# Altium schematic sheet ControlBoard.SchDoc
size A4; SheetNumber: 1; SheetTotal: 1; SPICEModelCacheKQEIREZP: <root> / <DocumentId>KQEIREZP</DocumentId> / </root>
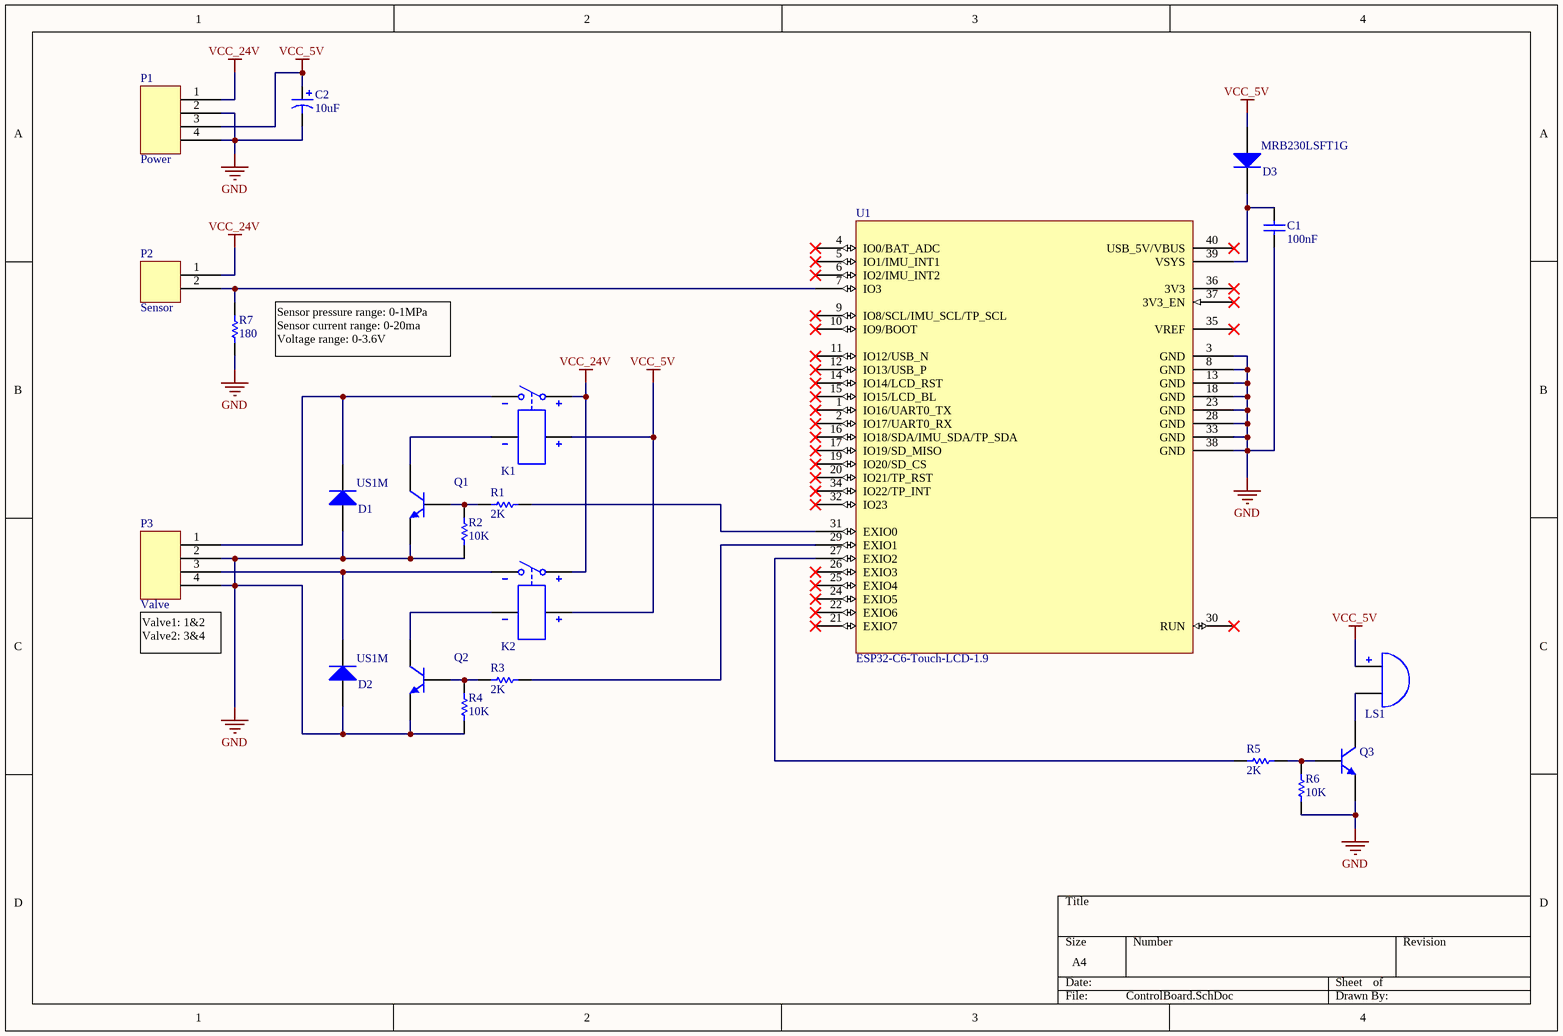
[diagram p0: ControlBoard.SchDoc]

## Parts
C1  value 100nF  [CAP0603/M]  (hidden comment: Cap)
C2  value 10uF  [CAPMP6032/M]  (hidden comment: Cap Pol)
D1  US1M  [DO-214AC/M]
D2  US1M  [DO-214AC/M]
D3  MRB230LSFT1G  [SOD-123FL/M]
K1  ENMG Solid State Relay  [PMN5D6132]  (value not drawn)
K2  ENMG Solid State Relay  [PMN5D6132]  (value not drawn)
LS1  Buzzer  [Buzzer-2310]  (value not drawn)
P1  Power  [KEFA/KF128L-3.81-04P]
P2  Sensor  [KEFA/KF128L-3.81-02P]
P3  Valve  [KEFA/KF128L-3.81-04P]
Q1  NPN  [SOT-23/M]  (value not drawn)
Q2  NPN  [SOT-23/M]  (value not drawn)
Q3  NPN  [SOT-23/M]  (value not drawn)
R1  value 2K  [RES0603/M]  (hidden comment: Res)
R2  value 10K  [RES0603/M]  (hidden comment: Res)
R3  value 2K  [RES0603/M]  (hidden comment: Res)
R4  value 10K  [RES0603/M]  (hidden comment: Res)
R5  value 2K  [RES0603/M]  (hidden comment: Res)
R6  value 10K  [RES0603/M]  (hidden comment: Res)
R7  value 180  [RES2512/L]  (hidden comment: Res)
U1  ESP32-C6-Touch-LCD-1.9  [ESP32-C6-Touch-LCD-1.9_Socket]

## Nets
GND: C1.2 C2.N D1.P(A) D2.P(A) P1.2 P1.4 P3.2 P3.4 Q1.E Q2.E Q3.E R2.1 R4.1 R6.1 R7.2 U1.3(GND) U1.8(GND) U1.13(GND) U1.18(GND) U1.23(GND) U1.28(GND) U1.33(GND) U1.38(GND)
VCC_5V: C2.P D3.P(A) K1.3 K2.3 LS1.P P1.3
VCC_24V: K1.2 K2.2 P1.1 P2.1
NetC1_1: C1.1 D3.N(K) U1.39(VSYS)
NetD1_N: D1.N(K) K1.1 P3.1
NetD2_N: D2.N(K) K2.1 P3.3
NetK1_4: K1.4 Q1.C
NetK2_4: K2.4 Q2.C
NetLS1_N: LS1.N Q3.C
NetP2_2: P2.2 R7.1 U1.7(IO3)
NetQ1_B: Q1.B R1.2 R2.2
NetQ2_B: Q2.B R3.2 R4.2
NetQ3_B: Q3.B R5.1 R6.2
NetR1_1: R1.1 U1.31(EXIO0)
NetR3_1: R3.1 U1.29(EXIO1)
NetR5_2: R5.2 U1.27(EXIO2)

Not connected (* = marked no-connect by the designer): U1 1(IO16/UART0_TX)* 2(IO17/UART0_RX)* 4(IO0/BAT_ADC)* 5(IO1/IMU_INT1)* 6(IO2/IMU_INT2)* 9(IO8/SCL/IMU_SCL/TP_SCL)* 10(IO9/BOOT)* 11(IO12/USB_N)* 12(IO13/USB_P)* 14(IO14/LCD_RST)* 15(IO15/LCD_BL)* 16(IO18/SDA/IMU_SDA/TP_SDA)* 17(IO19/SD_MISO)* 19(IO20/SD_CS)* 20(IO21/TP_RST)* 21(EXIO7)* 22(EXIO6)* 24(EXIO5)* 25(EXIO4)* 26(EXIO3)* 30(RUN)* 32(IO23)* 34(IO22/TP_INT)* 35(VREF)* 36(3V3)* 37(3V3_EN)* 40(USB_5V/VBUS)*

## Notes on the sheet
- (near R7) Sensor pressure range: 0-1MPa
  Sensor current range: 0-20ma
  Voltage range: 0-3.6V
- (near P3) Valve1: 1&2
  Valve2: 3&4

## Library data of the parts
C1 = Cap: Capacitor; Published: 8-Jun-2000; LatestRevisionDate: 17-Jul-2002; LatestRevisionNote: Re-released for DXP Platform.; PackageReference: RAD-0.3; Publisher: Altium Limited; PackageDescription: Radial Cap, Thru-Hole; 2 Leads; 0.3 in Pin Spacing
C2 = CapPol: Polarized Capacitor; Published: 8-Jun-2000; LatestRevisionDate: 17-Jul-2002; LatestRevisionNote: Re-released for DXP Platform.; PackageReference: POLAR0.8; Publisher: Altium Limited; PackageDescription: Polarized Capacitor; 2 Leads
D1 D2 = Diode US1M: 1 Amp Ultra Fast Rectifier SMA; ComponentLink1Description: Manufacturer Link; ComponentLink1URL: http://www.fairchildsemi.com/; ComponentLink2Description: Datasheet; ComponentLink2URL: http://www.fairchildsemi.com/ds/1N%2F1N4934.pdf
D3 = Diode MRB230LSFT1G: Schottky Barrier Rectifier 2A 30V; ComponentLink1Description: Manufacturer Link; ComponentLink1URL: http://www.fairchildsemi.com/; ComponentLink2Description: Datasheet; ComponentLink2URL: http://www.fairchildsemi.com/ds/1N%2F1N4934.pdf
K1 K2 = PMN5D6132: ENMG Solid State Relay PMN5D6132
P1 P3 = Header-4
P2 = Header-2
Q1-Q3 = MMBT5551: NPN Bipolar Transistor
R1-R7 = Res: Resistor; Published: 8-Jun-2000; LatestRevisionDate: 17-Jul-2002; LatestRevisionNote: Re-released for DXP Platform.; PackageReference: AXIAL-0.3; Publisher: Altium Limited; PackageDescription: Axial Device, Thru-Hole; 2 Leads; 0.3 in Pin Spacing
U1 = ESP32-C6-Touch-LCD-1.9: WaveShare ESP32-C6-Touch-LCD-1.9